# EAGLE schematic Blackberry_Trackballer_MountingPCB (EAGLE 7.1.0)
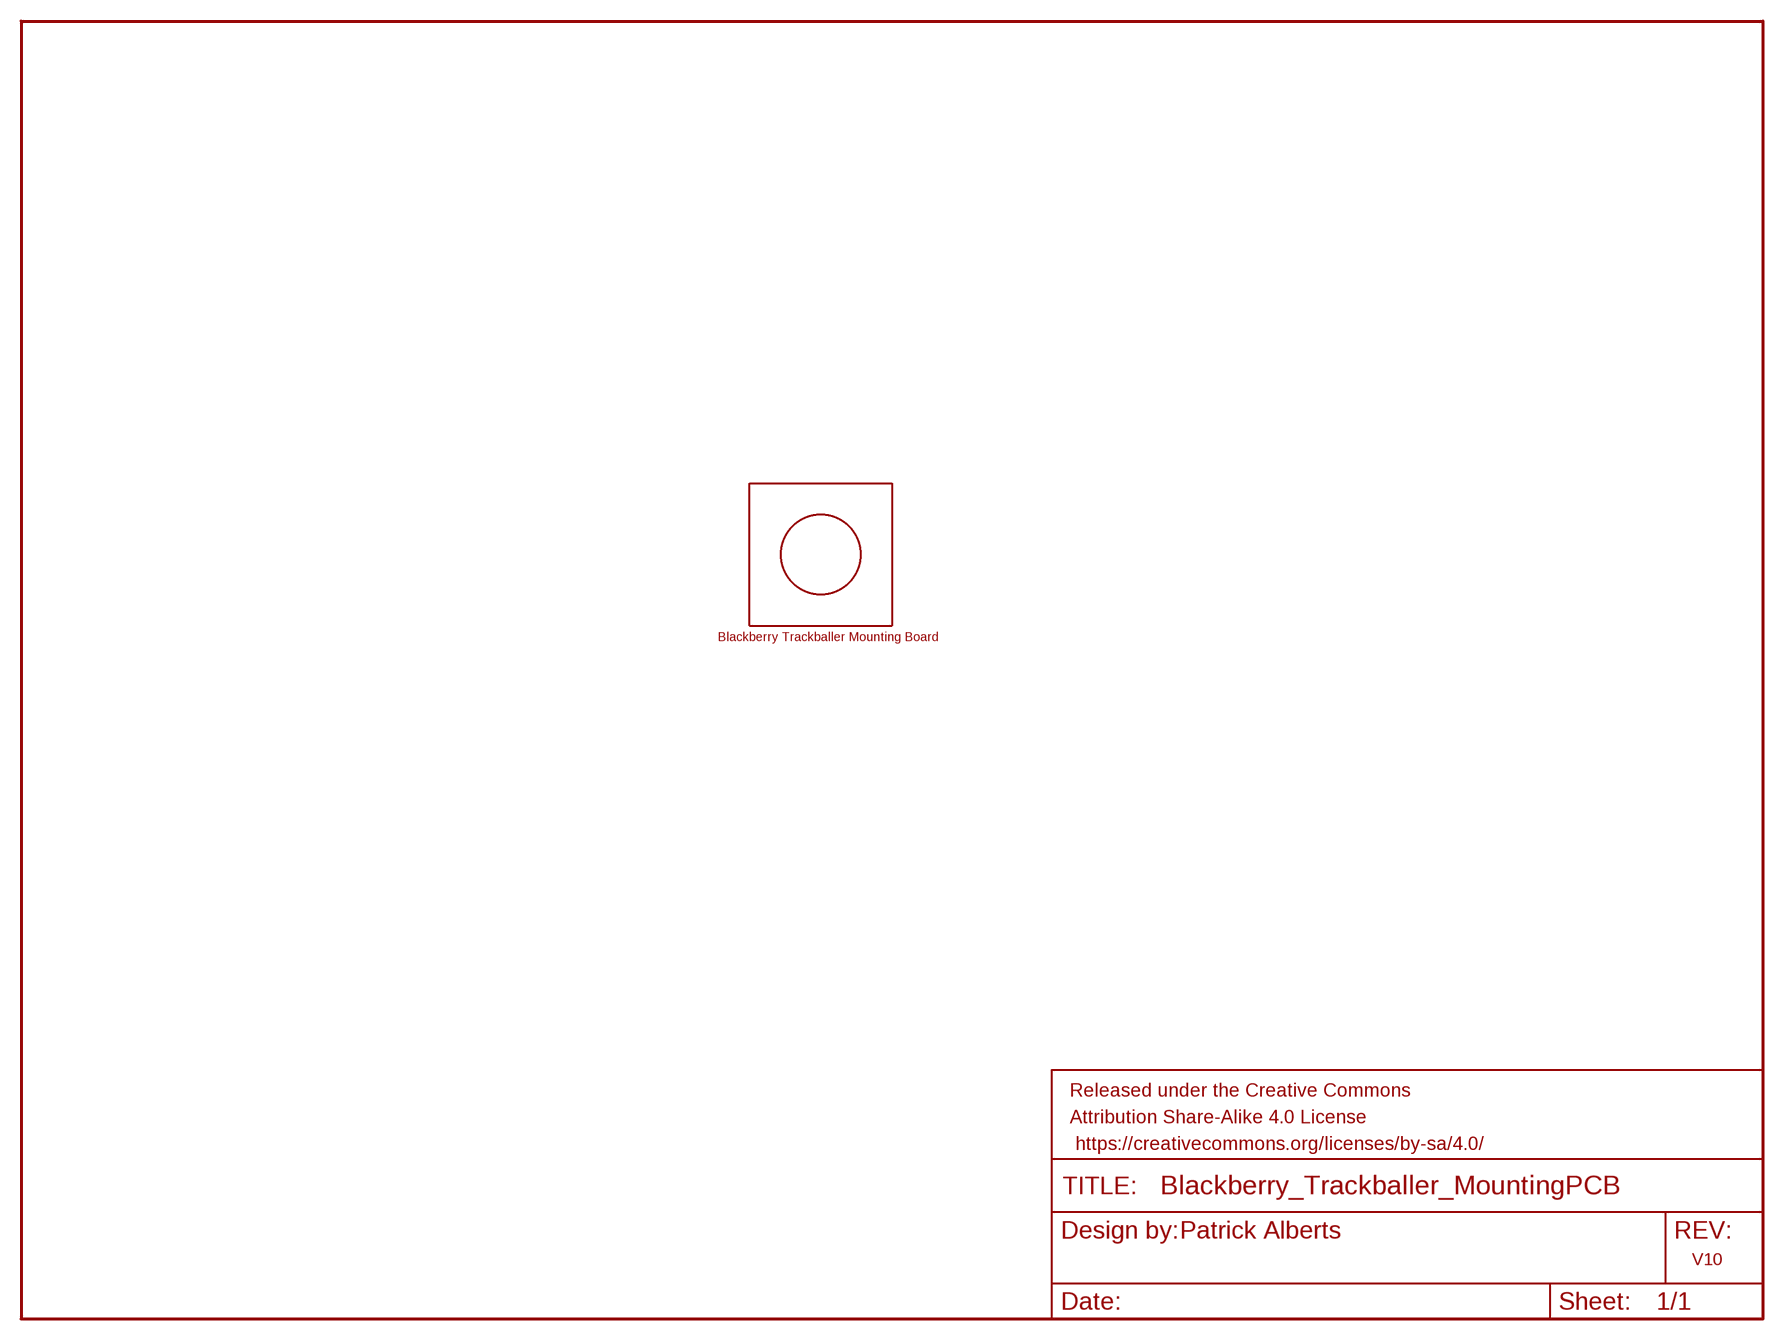
[diagram p0: schematic, sheet 1]

## Parts
FRAME1  FRAME-LETTER  [CREATIVE_COMMONS]
U$1  BLACKBERRY_TRACKBALLER  [BLACKBERRY_TRACKBALLER]

## Notes on the sheet
- Patrick Alberts
- V10

## Library data of the parts
FRAME1 = SparkFun-Aesthetics:FRAME-LETTER: Schematic Frame Standard 8.5x11 US Letter frame
U$1 = SparkFun-Boards:BLACKBERRY_TRACKBALLER